# Altium project TK531_Utgangstrinn.PrjPcb
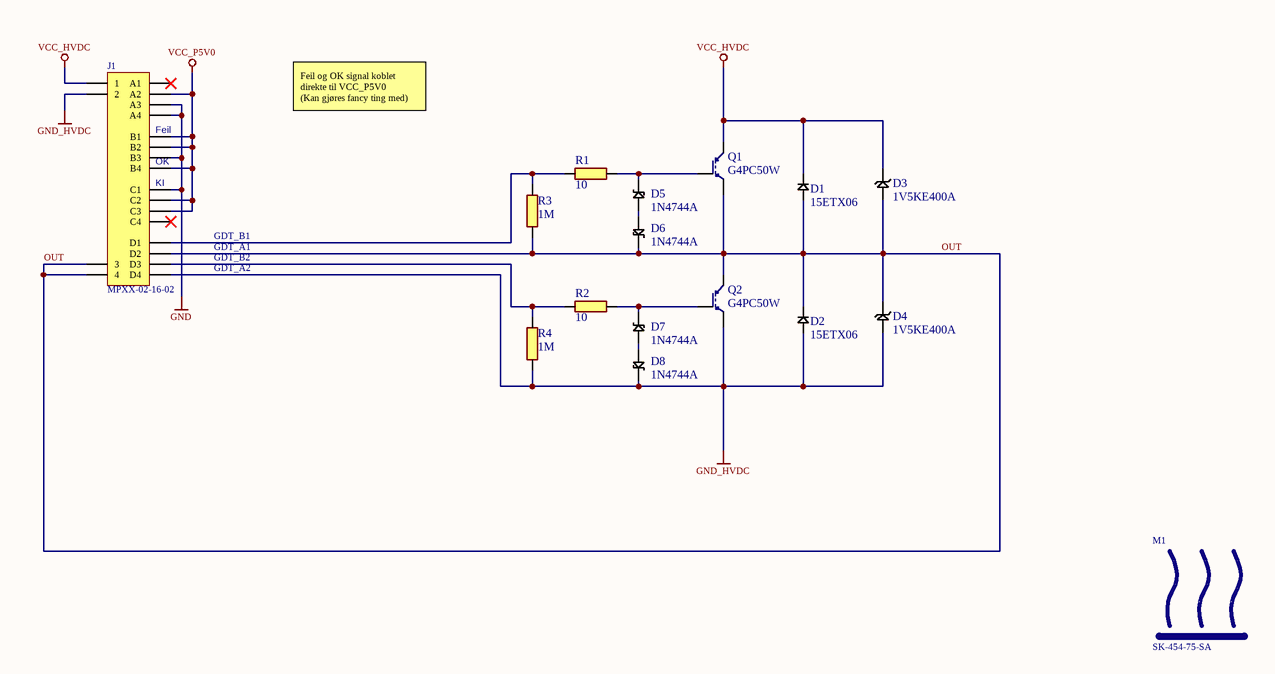
[diagram p0: TK531_Utgangstrinn.SchDoc]
1 sheet, 16 parts. Net scope: global (net labels, ports and power ports of the same name join across sheets).
Board file: TK531_Utgangstrinn.PcbDoc

## Sheet TK531_Utgangstrinn.SchDoc: TK531 Utgangstrinn
size A3; Author: Øystein Smith; Organization: Omega Verksted; DocumentNumber: 1; Revision: 1.1; SheetNumber: 1; SheetTotal: 1

### Parts
D1  15ETX06  [TO-220-2P]
D2  15ETX06  [TO-220-2P]
D3  1V5KE400A  [DO-201]
D4  1V5KE400A  [DO-201]
D5  1N4744A  [DO-41]
D6  1N4744A  [DO-41]
D7  1N4744A  [DO-41]
D8  1N4744A  [DO-41]
J1  MPXX-02-16-02  [MPTC-02-16-02-01-03-L-RA-SD]
M1  SK-454-75-SA  [SK-454-75-SA]
Q1  G4PC50W  [TO-247]
Q2  G4PC50W  [TO-247]
R1  10  [RESA_0.25W]
R2  10  [RESA_0.25W]
R3  1M  [RESC0603(1608)_N]
R4  1M  [RESC0603(1608)_N]

### Nets
GND: J1.7(A3) J1.8(A4) J1.11(B3) J1.13(C1)
GND_HVDC: D2.3(A) D4.1(A) D8.2(K) J1.2 J1.20(D4) Q2.3(E) R4.1
VCC_HVDC: D1.1(K) D3.2(K) J1.1 Q1.2(C)
VCC_P5V0: J1.6(A2) J1.9(B1) J1.10(B2) J1.12(B4) J1.14(C2) J1.15(C3)
OUT: D1.3(A) D2.1(K) D3.1(A) D4.2(K) D6.2(K) J1.3 J1.4 J1.18(D2) Q1.3(E) Q2.2(C) R3.1
NetD5_1: D5.1(A) D6.1(A)
NetD5_2: D5.2(K) Q1.1(G) R1.2
NetD7_1: D7.1(A) D8.1(A)
NetD7_2: D7.2(K) Q2.1(G) R2.2
NetJ1_17: J1.17(D1) R1.1 R3.2
NetJ1_19: J1.19(D3) R2.1 R4.2

Not connected (* = marked no-connect by the designer): J1 5(A1)* 16(C4)*

### Notes on the sheet
- (near J1) Feil
- Feil og OK signal koblet direkte til VCC_P5V0
  (Kan gjøres fancy ting med)
- (near J1) OK
- (near J1) KI
- GDT_B1
- GDT_B2
- GDT_A1
- GDT_A2
- Size:
- Date:
- Title:
- A3
- Revision:
- Sheet
- of
- Author:
- File:

### Library data of the parts
D1 D2 = 4891: DIODE, HYPERFAST, 15A, 600V; id: 4891; pakke_opprettet_av: 815; leverandor_varenr: 8656991; pris: 26; produsent: Vishay; leverandor: Farnell; pakketype: TO-220; komponenttype: 9; pakke_opprettet: 28/06/2014 18:52:03; symbol_opprettet_av: 815; symbol_opprettet: 07/06/2015 11:24:04; navn: 15ETX06
D3 D4 = 3261: TVS diode,  400V, 1500W; pakke_opprettet_av: 815; leverandor_varenr: 1017630; pris: 7; pakketype: DO; produsent: Fairchild; leverandor: Farnell; id: 3261; rad: 2; rom: OV; lager_type: Fremlager; dybde: 1; komponenttype: 9; navn: 1V5KE400A; pakke_opprettet: 28/06/2014 17:58:10; symbol_opprettet_av: 815; symbol_opprettet: 28/06/2014 15:19:53; hylle: 2; antall: 7
D5-D8 = 4876: Zenerdiode 15V 1.3W; id: 4876; pakke_opprettet_av: 815; leverandor_varenr: 1612369; pris: 2; produsent: Vishay; leverandor: Farnell; pakketype: DO; komponenttype: 9; pakke_opprettet: 28/06/2014 16:50:18; symbol_opprettet_av: 815; symbol_opprettet: 28/06/2014 15:11:05; navn: 1N4744A
J1 = 3221: SAMTEC Connector; pakke_opprettet_av: 815; pris: 30; pakketype: TH; id: 3221; komponenttype: 11; leverandor: Mouser; nokkelord: Kan kjøpes rett fra SAMTEC; navn: MPTC-02-16-02-01-03-L-RA-SD; pakke_opprettet: 13/07/2014 16:35:56; symbol_opprettet_av: 815; symbol_opprettet: 13/07/2014 16:35:21; produsent: SAMTEC; leverandor_varenr: MPTC-02-16-02-01-03-L-RA-SD
M1 = 4718: Heatsink; pakke_opprettet_av: 815; pris: 14; nokkelord: Kjøleribbe; produsent: FischerElektronik; id: 4718; leverandor_varenr: 1850030; leverandor: Farnell; navn: SK-454-75-SA; pakke_opprettet: 07/06/2015 12:19:05; symbol_opprettet_av: 815; symbol_opprettet: 07/06/2015 12:24:06; pakketype: -
Q1 Q2 = 4877: IGBT, 600V, 55A; pakke_opprettet_av: 815; leverandor_varenr: 8650632; pris: 77; nokkelord: Tesla; produsent: International Rectifier; leverandor: Farnell; id: 4877; komponenttype: 4; navn: G4PC50W; pakke_opprettet: 28/06/2014 15:05:36; symbol_opprettet_av: 815; symbol_opprettet: 28/06/2014 15:03:36; pakketype: TO-247
R1 R2 = 3890: 0.25W 1% Generic resistor; id: 3890; rad: 1; rom: OV; lager_type: Fremlager; dybde: 0; hylle: 5; antall: 100; pakke_opprettet_av: 815; nokkelord: Motstand, Resistor; pakketype: TH; leverandor: Farnell; leverandor_varenr: 9341145; produsent: Multicomp; pakke_opprettet: 28/06/2014 17:13:33; symbol_opprettet_av: 815; symbol_opprettet: 08/07/2014 21:16:33; navn: 10; pris: 0; komponenttype: 1
R3 R4 = 5340: 0.1W 1% Thick film resistor; id: 5340; rad: -1; rom: OV; lager_type: Fremlager; dybde: 119; hylle: 2; antall: 100; pakke_opprettet_av: 815; pris: 0; nokkelord: Resistor Motstand; pakketype: 0603; komponenttype: 1; leverandor: Farnell; leverandor_varenr: 2073358; produsent: Multicomp; pakke_opprettet: 08/07/2014 21:15:30; symbol_opprettet_av: 815; symbol_opprettet: 08/07/2014 21:16:33; navn: 1M